# Altium schematic sheet MAXREFDES117.SchDoc
size A0; SheetNumber: 1; SheetTotal: 1
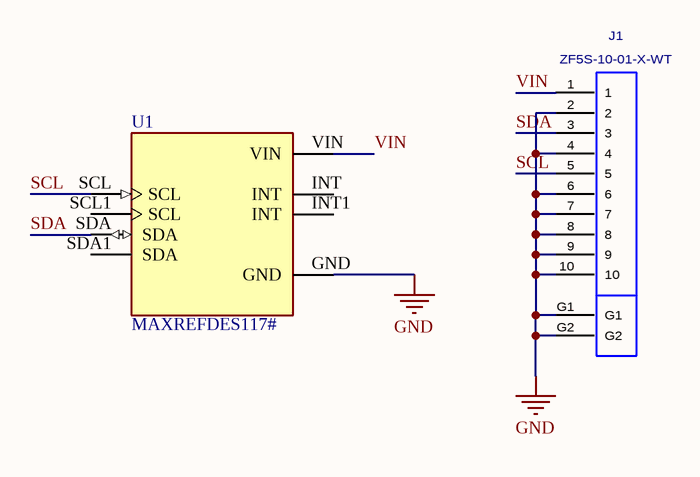
[diagram p0: MAXREFDES117.SchDoc]

## Parts
J1  ZF5S-10-01-X-WT  [ZF5S-10-01-X-WT]
U1  MAXREFDES117#  [MODULE_MAXREFDES117#]

## Nets
GND: J1.2 J1.4 J1.6 J1.7 J1.8 J1.9 J1.10 J1.G1 J1.G2 U1.GND
SCL: J1.5 U1.SCL
SDA: J1.3 U1.SDA
VIN: J1.1 U1.VIN

Not connected (* = marked no-connect by the designer): U1 INT INT1(INT) SCL1(SCL) SDA1(SDA)

## Library data of the parts
J1 = ZF5S-10-01-X-WT: ZERO INSERTION FORCE 0.5MM ASSEMBLY, 01 LEAD STYLE.; MANUFACTURER: SAMTEC; CREATED: January 30, 2015 - Wendy Xin; PCB DECAL: ZF5S-10-01-X-WT
U1 = MAXREFDES117#: MAX1921, MAX14595, MAX30102 - Medical, Pulse Oximeter (PO or SpO2) Sensor Evaluation Board; MF: Maxim Integrated; Price: None; Availability: Unavailable; Value: *; MP: MAXREFDES117#; Mouser-Purchase-URL: https://snapeda.com/shop?store=Mouser&id=585423; DigiKey-Purchase-URL: https://snapeda.com/shop?store=DigiKey&id=585423; SnapEDA_Link: https://www.snapeda.com/parts/MAXREFDES117%23/Maxim%20Integrated/view-part/585423/?ref=snap; Package: None